# EAGLE design ILI9488_touch_breakout (EAGLE 6.5.0)
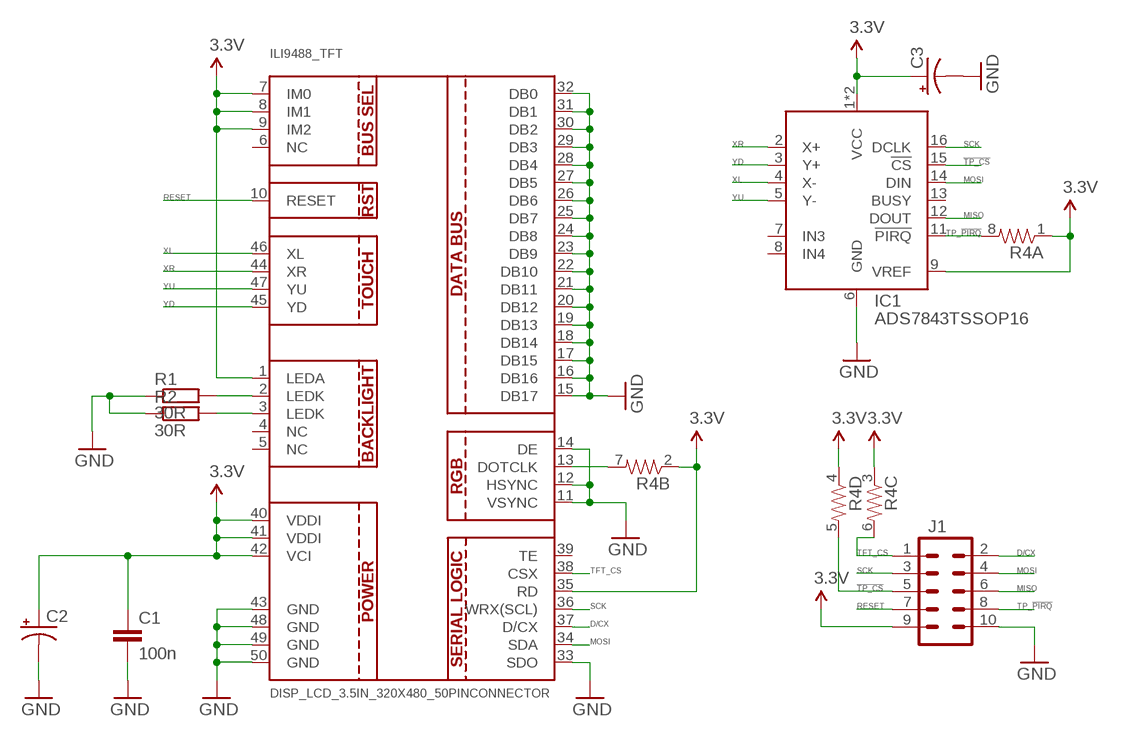
[diagram p0: schematic, sheet 1]

## Parts
C1  100n  C-EUC0805K  [C0805K]
C2  CAPACITOR-POL0805  [0805A]
C3  CAPACITOR-POL0805  [0805A]
IC1  ADS7843TSSOP16  [TSSOP16]
ILI9488_TFT  DISP_LCD_3.5IN_320X480_50PINCONNECTOR  [TFT_3.5IN_50PIN_CONNECTOR]
J1  M05X2PTH  [AVR_ICSP]
R1  30R  R-EU_M0805  [M0805]
R2  30R  R-EU_M0805  [M0805]
R4  RESISTOR-ARRAY0603-ARV  [0603-ARV]

## Nets
3.3V: C1.1 C2.+ C3.+ IC1.1(VCC) IC1.9(VREF) IC1.10(VCC) ILI9488_TFT.1(LEDA) ILI9488_TFT.7(IM0) ILI9488_TFT.8(IM1) ILI9488_TFT.9(IM2) ILI9488_TFT.35(RD) ILI9488_TFT.40(VDDI) ILI9488_TFT.41(VDDI) ILI9488_TFT.42(VCI) J1.9 R4.1 R4.2 R4.3 R4.4
!TP_CS: IC1.15(!CS) J1.5 R4.5
D/CX: ILI9488_TFT.37(D/CX) J1.2
GND: C1.2 C2.- C3.- IC1.6(GND) ILI9488_TFT.11(VSYNC) ILI9488_TFT.12(HSYNC) ILI9488_TFT.14(DE) ILI9488_TFT.15(DB17) ILI9488_TFT.16(DB16) ILI9488_TFT.17(DB15) ILI9488_TFT.18(DB14) ILI9488_TFT.19(DB13) ILI9488_TFT.20(DB12) ILI9488_TFT.21(DB11) ILI9488_TFT.22(DB10) ILI9488_TFT.23(DB9) ILI9488_TFT.24(DB8) ILI9488_TFT.25(DB7) ILI9488_TFT.26(DB6) ILI9488_TFT.27(DB5) ILI9488_TFT.28(DB4) ILI9488_TFT.29(DB3) ILI9488_TFT.30(DB2) ILI9488_TFT.31(DB1) ILI9488_TFT.32(DB0) ILI9488_TFT.33(SDO) ILI9488_TFT.43(GND) ILI9488_TFT.48(GND) ILI9488_TFT.49(GND) ILI9488_TFT.50(GND) J1.10 R1.1 R2.1
MISO: IC1.12(DOUT) J1.6
MOSI: IC1.14(DIN) ILI9488_TFT.34(SDA) J1.4
N$1: ILI9488_TFT.2(LEDK) R1.2
N$2: ILI9488_TFT.3(LEDK) R2.2
N$15: ILI9488_TFT.13(DOTCLK) R4.7
RESET: ILI9488_TFT.10(RESET) J1.7
SCK: IC1.16(DCLK) ILI9488_TFT.36(WRX(SCL)) J1.3
TFT_CS: ILI9488_TFT.38(CSX) J1.1 R4.6
TP_!PIRQ: IC1.11(!PIRQ) J1.8 R4.8
XL: IC1.4(X-) ILI9488_TFT.46(XL)
XR: IC1.2(X+) ILI9488_TFT.44(XR)
YD: IC1.3(Y+) ILI9488_TFT.45(YD)
YU: IC1.5(Y-) ILI9488_TFT.47(YU)
Unconnected: IC1.7(IN3) IC1.8(IN4) IC1.13(BUSY) ILI9488_TFT.4(NC) ILI9488_TFT.5(NC) ILI9488_TFT.6(NC) ILI9488_TFT.39(TE)

## Library data of the parts
C1 = resistor:C-EU: CAPACITOR, European symbol
C2 C3 = audioint:CAPACITOR-POL
IC1 = analog-devices:ADS7843: ADS7843 / AD7843 / XPT2046 Touch controller IC
ILI9488_TFT = adafruit:DISP_LCD_3.5IN_320X480_50PIN: ILI9488 TFT display breakout from buydisplay.com with resistive touchscreen
J1 = SparkFun-Connectors:M05X2: Header 5x2 Standard 10-pin dual row 0.1" header. Commonly used with AVR-ISP. Use with Spark Fun Electronics SKU: PRT-00778
R1 R2 = resistor:R-EU_: RESISTOR, European symbol
R4 = SparkFun-Passives:RESISTOR-ARRAY: Array Chip Resistor Source: RS Component / Phycomp

## Board
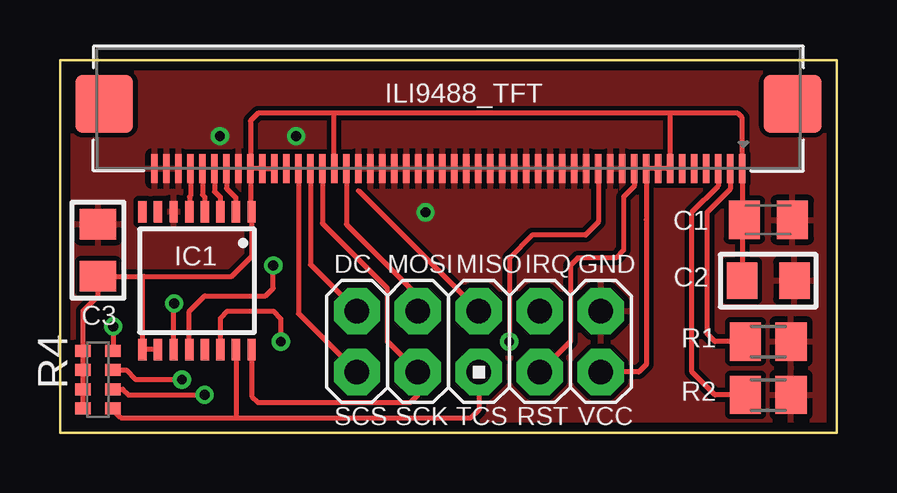
[diagram p1: board, top side]
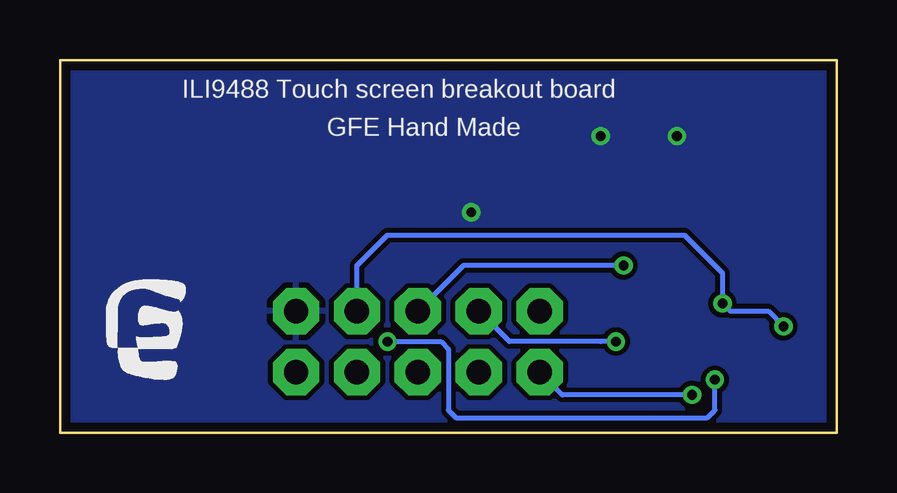
[diagram p2: board, bottom side, seen from below]

Size 32.38 x 15.56 mm. Coordinates in mm from the lower left corner, seen from the top.
Outline: 0,0 32.39,0 32.39,15.56 0,15.56 0,0
Copper layers (1*16): Top 0.0356mm / dielectric 1.5011mm / Bottom 0.0356mm
Design rules "OSHPARK *": minimum track width 6mil, minimum drill 13mil, track to track 6mil, track to pad 6mil, pad to pad 6mil, via to via 6mil, smd to smd 6mil, copper to edge 15mil, drill to drill 6mil, minimum pad ring 18mil, minimum via ring 7mil, stop-mask expansion 3mil, vias tented up to drill 0mil, thermal gap 10mil

### Footprints (pad centres in the part's own frame; a part is rotated, then mirrored left to right if it is on the bottom)
C0805K = smd 1.3 x 1.6: 1 -1,0; 2 1,0
0805A = smd 1.27 x 1.524: + 1.091,0; - -1.091,0
TSSOP16 = smd 0.9 x 0.35: 1 -2.875,2.275; 2 -2.875,1.625; 3 -2.875,0.975; 4 -2.875,0.325; 5 -2.875,-0.325; 6 -2.875,-0.975; 7 -2.875,-1.625; 8 -2.875,-2.275; 9 2.875,-2.275; 10 2.875,-1.625; 11 2.875,-0.975; 12 2.875,-0.325; 13 2.875,0.325; 14 2.875,0.975; 15 2.875,1.625; 16 2.875,2.275
TFT_3.5IN_50PIN_CONNECTOR = smd 0.275 x 1.2 bottom: 1 12.25,2.31; 2 11.75,2.31; 3 11.25,2.31; 4 10.75,2.31; 5 10.25,2.31; 6 9.75,2.31; 7 9.25,2.31; 8 8.75,2.31; 9 8.25,2.31; 10 7.75,2.31; 11 7.25,2.31; 12 6.75,2.31; 13 6.25,2.31; 14 5.75,2.31; 15 5.25,2.31; 16 4.75,2.31; 17 4.25,2.31; 18 3.75,2.31; 19 3.25,2.31; 20 2.75,2.31; 21 2.25,2.31; 22 1.75,2.31; 23 1.25,2.31; 24 0.75,2.31; 25 0.25,2.31; 26 -0.25,2.31; 27 -0.75,2.31; 28 -1.25,2.31; 29 -1.75,2.31; 30 -2.25,2.31; 31 -2.75,2.31; 32 -3.25,2.31; 33 -3.75,2.31; 34 -4.25,2.31; 35 -4.75,2.31; 36 -5.25,2.31; 37 -5.75,2.31; 38 -6.25,2.31; 39 -6.75,2.31; 40 -7.25,2.31; 41 -7.75,2.31; 42 -8.25,2.31; 43 -8.75,2.31; 44 -9.25,2.31; 45 -9.75,2.31; 46 -10.25,2.31; 47 -10.75,2.31; 48 -11.25,2.31; 49 -11.75,2.31; 50 -12.25,2.31 | smd 2.4 x 2.4 bottom: PAD1 14.35,-0.39; PAD2 -14.35,-0.39
AVR_ICSP = drill 1.016 pad 1.88 octagon: 1 -1.27,5.08; 2 1.27,5.08; 3 -1.27,2.54; 4 1.27,2.54; 5 -1.27,0; 6 1.27,0; 7 -1.27,-2.54; 8 1.27,-2.54; 9 -1.27,-5.08; 10 1.27,-5.08
M0805 = smd 1.3 x 1.6: 1 -0.95,0; 2 0.95,0
0603-ARV = smd 0.5 x 0.65: 1 -1.2,-0.625; 2 -0.4,-0.625; 3 0.4,-0.625; 4 1.2,-0.625; 5 1.2,0.625; 6 0.4,0.625; 7 -0.4,0.625; 8 -1.2,0.625

### Placement (x,y rotation side)
C1  29.53,8.89 0 top
C2  29.53,6.35 180 top
C3  1.59,7.62 270 top
IC1  5.71,6.35 270 top
ILI9488_TFT  16.19,13.34 180 bottom
J1  17.46,3.81 90 top
R1  29.53,3.81 180 top
R2  29.53,1.59 180 top
R4  1.59,2.22 270 top
U$1  [LOGO_PICCOLO]  30.48,2.22 0 bottom

### Tracks (layer width: path | path; a pad name or v marks a point on that pad's centre or on a via)
3.3V
  Top 0.203: IC1.10 IC1.9 3.44,6.48 3.49,6.53 | 28.44,8.26 ILI9488_TFT.1 28.44,13.15 28.26,13.34 25.4,13.34 | 28.44,8.26 C2.+ | C1.1 28.44,8.26 | 3.49,6.53 C3.+ 1.59,5.71 0.96,5.09 R4.1 R4.2 R4.3 R4.4 | 3.49,6.53 7.16,6.53 7.99,7.36 IC1.1 7.94,9.27 ILI9488_TFT.42 | ILI9488_TFT.40 ILI9488_TFT.41 ILI9488_TFT.42 | ILI9488_TFT.42 7.94,13.02 8.26,13.34 11.43,13.34 | 25.4,13.34 25.44,13.29 ILI9488_TFT.7 | ILI9488_TFT.7 ILI9488_TFT.8 | ILI9488_TFT.9 24.44,2.85 24.13,2.54 J1.9 | ILI9488_TFT.7 ILI9488_TFT.9 | 25.4,13.34 11.43,13.34 | ILI9488_TFT.9 24.44,8.89 | ILI9488_TFT.35 11.43,11.03 11.43,13.34
!TP_CS
  Top 0.203: J1.5 17.46,0.95 17.14,0.64 7.3,0.64 | IC1.15 7.34,0.67 7.3,0.64 | 7.3,0.64 2.54,0.64 2.15,1.02 R4.5
D/CX
  Top 0.203: ILI9488_TFT.37 10.44,7.02 J1.2
GND  (via drill 0.41)
  other vias: 15.24,9.21 9.84,12.38 6.67,12.38
  pour Bottom (isolate 0.203): -1.59,-3.17 33.97,-3.17 33.97,20.95 -1.59,20.95
  pour Top (isolate 0.203): -2.86,-4.45 35.24,-4.45 35.24,22.22 -2.86,22.22
MISO  (via drill 0.41)
  Top 0.203: 12.44,10.1 J1.6 | IC1.12 5.39,5.07 6.03,5.71 8.57,5.71 8.89,6.03 v8.89,6.99
  Bottom 0.203: v8.89,6.99 15.56,6.99 J1.6
MOSI  (via drill 0.41)
  Top 0.203: ILI9488_TFT.34 11.94,8.7 14.92,5.71 J1.4 | IC1.14 6.69,4.79 6.98,5.08 8.89,5.08 9.21,4.76 v9.21,3.81
  Bottom 0.203: J1.4 13.65,3.81 9.84,3.81 v9.21,3.81
N$1
  Top 0.203: R1.2 27.3,3.81 26.99,4.13 26.99,9.21 27.94,10.16 ILI9488_TFT.2
N$2
  Top 0.203: R2.2 27.3,1.59 26.35,2.54 26.35,9.21 27.44,10.3 ILI9488_TFT.3
N$15  (via drill 0.41)
  Top 0.203: ILI9488_TFT.13 22.44,8.79 21.91,8.26 19.69,8.26 18.73,7.3 v18.73,3.81 | R4.7 2.78,2.62 3.18,2.22 v5.08,2.22
  Bottom 0.203: v18.73,3.81 16.51,3.81 16.19,3.49 16.19,0.95 15.87,0.64 5.4,0.64 5.08,0.95 v5.08,2.22
RESET
  Top 0.203: ILI9488_TFT.10 23.94,10.29 23.5,9.84 23.5,7.62 23.18,7.3 21.59,7.3 21.27,6.99 21.27,3.81 J1.7
SCK
  Top 0.203: ILI9488_TFT.36 10.94,8.74 13.65,6.03 13.65,3.81 J1.3 14.92,1.59 14.6,1.27 8.26,1.27 7.99,1.53 IC1.16
TFT_CS  (via drill 0.41)
  Top 0.203: ILI9488_TFT.38 9.94,4.98 J1.1 | R4.6 2.62,1.82 2.86,1.59 v6.03,1.59
  Bottom 0.203: v6.03,1.59 11.43,1.59 J1.1
TP_!PIRQ  (via drill 0.41)
  Top 0.203: v2.22,4.45 R4.8 | IC1.11 4.74,5.38 v4.76,5.4
  Bottom 0.203: J1.8 20,6.99 18.73,8.26 6.35,8.26 4.76,6.67 4.76,5.71 v4.76,5.4 4.45,5.08 2.86,5.08 v2.22,4.45
XL
  Top 0.203: ILI9488_TFT.46 5.94,9.93 6.03,9.84 IC1.4
XR
  Top 0.203: ILI9488_TFT.44 6.94,10.2 7.34,9.8 IC1.2
YD
  Top 0.203: ILI9488_TFT.45 6.44,10.07 6.69,9.82 IC1.3
YU
  Top 0.203: ILI9488_TFT.47 5.44,9.89 5.4,9.84 IC1.5

### Text on the board
tPlace: DC | MOSI | MISO | IRQ | GND | SCS | SCK | TCS | RST | VCC
bPlace: ILI9488 Touch screen breakout board | GFE Hand Made